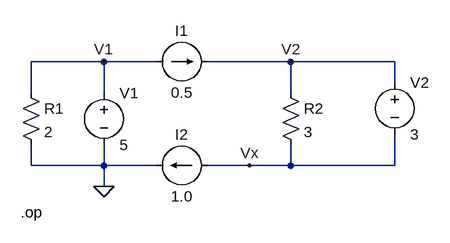
[diagram p0: schematic nodal13.asc]
nodal13.asc, the LTspice schematic file:
Version 4
SHEET 1 880 680
WIRE 16 80 -96 80
WIRE 96 80 16 80
WIRE 304 80 176 80
WIRE 464 80 304 80
WIRE 464 112 464 80
WIRE -96 128 -96 80
WIRE 16 128 16 80
WIRE 304 128 304 80
WIRE -96 240 -96 208
WIRE 16 240 16 208
WIRE 16 240 -96 240
WIRE 96 240 16 240
WIRE 240 240 176 240
WIRE 304 240 304 208
WIRE 304 240 240 240
WIRE 464 240 464 192
WIRE 464 240 304 240
WIRE 16 272 16 240
FLAG 16 80 V1
FLAG 304 80 V2
FLAG 240 240 Vx
FLAG 16 272 0
SYMBOL voltage 16 112 R0
WINDOW 123 0 0 Left 0
WINDOW 39 0 0 Left 0
SYMATTR InstName V1
SYMATTR Value 5
SYMBOL current 96 80 R270
WINDOW 0 32 40 VTop 2
WINDOW 3 -32 40 VBottom 2
WINDOW 123 0 0 Left 0
WINDOW 39 0 0 Left 0
SYMATTR InstName I1
SYMATTR Value 0.5
SYMBOL current 176 240 R90
WINDOW 0 -32 40 VBottom 2
WINDOW 3 32 40 VTop 2
WINDOW 123 0 0 Left 0
WINDOW 39 0 0 Left 0
SYMATTR InstName I2
SYMATTR Value 1.0
SYMBOL res -112 112 R0
SYMATTR InstName R1
SYMATTR Value 2
SYMBOL res 288 112 R0
SYMATTR InstName R2
SYMATTR Value 3
SYMBOL voltage 464 96 R0
WINDOW 123 0 0 Left 0
WINDOW 39 0 0 Left 0
SYMATTR InstName V2
SYMATTR Value 3
TEXT -112 312 Left 2 !.op

The netlist it stands for:
* nodal13.asc
V1 V1 0 5
I1 V1 V2 0.5
I2 Vx 0 1.0
R1 V1 0 2
R2 V2 Vx 3
V2 V2 Vx 3
.op
.backanno
.end